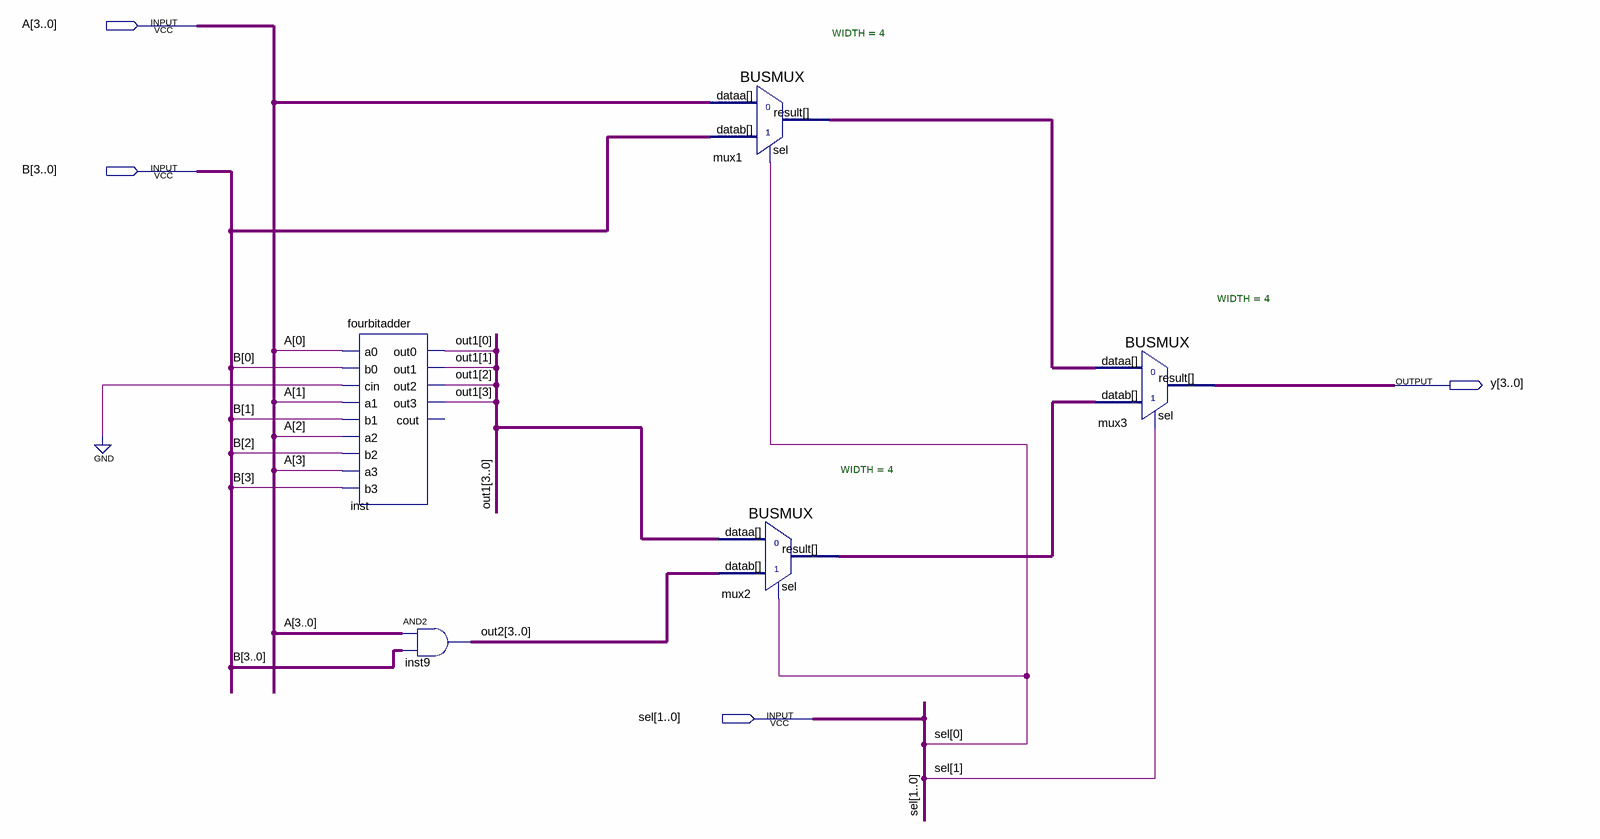
[diagram p0: schematic sheet]
// Quartus schematic ALU.bdf as structural Verilog: 5 symbols, 4 pins
module ALU (
  input  [3:0] A,
  input  [3:0] B,
  input  [1:0] sel,
  output [3:0] y
);

  wire [3:0] mux1_result, mux2_result, out1, out2;

  fourbitadder inst (
    .a0(A[0]), .b0(B[0]), .cin(1'b0), .a1(A[1]), .b1(B[1]), .a2(A[2]), .b2(B[2]), .a3(A[3]), .b3(B[3]),
    .out0(out1[0]), .out1(out1[1]), .out2(out1[2]), .out3(out1[3]));  // open: cout
  assign out2 = A & B;  // AND2 inst9, 4 bits wide
  BUSMUX #(.WIDTH(4)) mux1 (.datab(B), .sel(sel[0]), .dataa(A), .result(mux1_result));
  BUSMUX #(.WIDTH(4)) mux2 (.datab(out2), .sel(sel[0]), .dataa(out1), .result(mux2_result));
  BUSMUX #(.WIDTH(4)) mux3 (.datab(mux2_result), .sel(sel[1]), .dataa(mux1_result), .result(y));
endmodule
